# Altium schematic sheet v1.1.SchDoc
size 118 x 71 mm
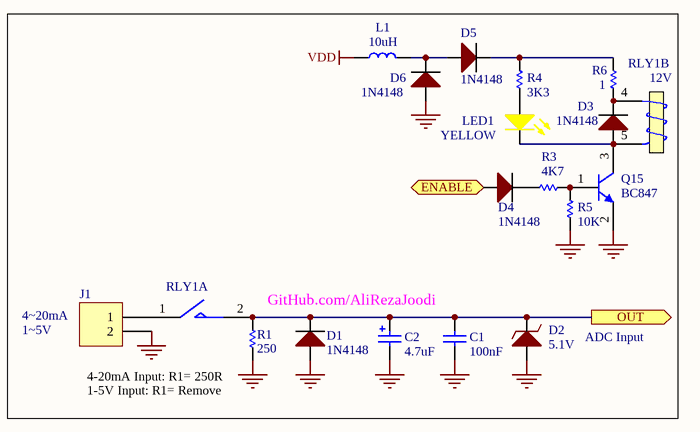
[diagram p0: v1.1.SchDoc]

## Parts
C1  100nF  [CAPNTO2.54-3.05x1.78A]
C2  4.7uF  [CAPPR2.5-6.3x5]
D1  1N4148  [D_THD_AXIAL0.3_DO-35]
D2  5.1V  [D_THD_AXIAL0.3_DO-35]
D3  1N4148  [D_THD_AXIAL0.3_DO-35]
D4  1N4148  [D_THD_AXIAL0.3_DO-35]
D5  1N4148  [D_THD_AXIAL0.3_DO-35]
D6  1N4148  [D_THD_AXIAL0.3_DO-35]
J1  Header 2  [Fonics_2PIN_1]  (value not drawn)
L1  10uH
LED1  YELLOW  [LED_THD_3MM_YELLOW_R]
Q1  Q15  value BC847  [SOT23-3N]
R1  250  [R_THD_AXIAL0.4(1/4W)]
R3  4K7  [R_THD_AXIAL0.4(1/4W)]
R4  3K3  [R_THD_AXIAL0.4(1/4W)]
R5  10K  [R_THD_AXIAL0.4(1/4W)]
R6  1  [R_THD_AXIAL0.4(1/4W)]
RLY1  RELAU  [RELAY-SPDT-2]  (value not drawn)  (parts A,B of 2)

## Ports
ENABLE (in), OUT (out)

## Nets
GND: C1.1 C2.2 D1.1(A) D2.1 D6.1(A) J1.2 Q1.2(E) R1.2 R5.1
VDD: L1.1
ENABLE: D4.1(A) ; port ENABLE
OUT: C1.2 C2.1 D1.2(K) D2.2 R1.1 RLY1.2(NO) ; port OUT
NetD3_1: D3.1(A) LED1.2(K) Q1.3(C) RLY1.5(T2)
NetD3_2: D3.2(K) R6.2 RLY1.4(T1)
NetD4_2: D4.2(K) R3.2
NetD5_1: D5.1(A) D6.2(K) L1.2
NetD5_2: D5.2(K) R4.2 R6.1
NetJ1_1: J1.1 RLY1.1(COM)
NetLED1_1: LED1.1(A) R4.1
NetQ1_1: Q1.1(B) R3.1 R5.2

## Notes on the sheet
- GitHub.com/AliRezaJoodi
- 4~20mA
- 1~5V
- ADC Input
- 4-20mA Input: R1= 250R
  1-5V Input: R1= Remove

## Library data of the parts
C1 = Cap: Capacitor; Manufacturer: Generic Components; Class I: Passive; Published: 8-Jun-2000; Revision: July-2002: Re-released for DXP Platform.; Publisher: Altium Limited; Class II: Capacitor
C2 = Cap Pol1: Polarized Capacitor (Radial); Manufacturer: Generic Components; Class I: Passive; Published: 8-Jun-2000; Revision: July-2002: Re-released for DXP Platform.; Publisher: Altium Limited; Class II: Capacitor
D1 D3-D6 = Diode_2Form: Diode,; Revision: July-2002: Re-released for DXP Platform.
D2 = Diode_Zener: Diode, Zener; Revision: July-2002: Re-released for DXP Platform.
J1 = Header 2: Header, 2-Pin; LatestRevisionDate: 17-Jul-2002; LatestRevisionNote: Re-released for DXP Platform.; Publisher: Altium Limited
L1 = Inductor_2Type: Inductor,
LED1 = LED_YELLOW: LED, Yellow; Manufacturer: Generic Components; Class I: Optoelectronic; Published: 8-Jun-2000; Revision: July-2002: Re-released for DXP Platform.; Publisher: Altium Limited; Class II: LED
Q1 = BC847: Silicon Bipolar Transistor
R1 R3-R6 = Resistor: Revision: July-2002: Re-released for DXP Platform.
RLY1 = RELAY-NY12W-K: Value: LM358; Published: 17-Jul-2002; LatestRevisionDate: 13-Apr-2006; LatestRevisionNote: IPC-7351 Footprint Added.; DatasheetVersion: 1988; PackageReference: 751-02; Publisher: Altium Limited; PackageDescription: 8-Pin Small Outline Integrated Circuit 1.27 mm Pitch; Code_JEDEC: MS-012-AA; Code_IPC: SOIC127P600-8; ComponentLink1Description: Manufacturer Link; ComponentLink1URL: http://www.onsemi.com/site/products/parametrics/0,4446,251,00.html; ComponentLink2Description: Datasheet; ComponentLink2URL: http://www.onsemi.com/pub/Collateral/LM358-D.PDF